# Altium schematic sheet AFPGA.SchDoc: Application FPGA
size 420 x 297 mm; CheckedBy: T.Janicki; CompanyName: Creotech Instruments SA; DrawnBy: G.Kasprowicz; Organization: CERN; Address1: European Organization for Nuclear Research; Address2: CH-1211 Geneve 23 - Switzerland; Revision: -; SheetNumber: 2; SheetTotal: 21; EDA_Number: EDA-xxxx; Projet: Simple VME FMC Carrier; ModifiedBy: -; CreateDate: 20/11/2012; CheckedDate: 30/04/2012; DivGrp: BE-CO; Designer: G.Kasprowicz; PageSetup: Record=PageOptions|CenterHorizontal=True|CenterVertical=True|PrintScale=0.95|XCorrection=1.00|YCorrection=1.00|PrintKind=1|BorderSize=5000000|LeftOffset=0|BottomOffset=0|Orientation=2|PaperLength=1000|PaperWidth=1000|Scale=100|PaperSource=15|PrintQuality=600|MediaType=1|DitherType=10|PaperKind=A3|PrintScaleMode=1; ModifiedDate: -
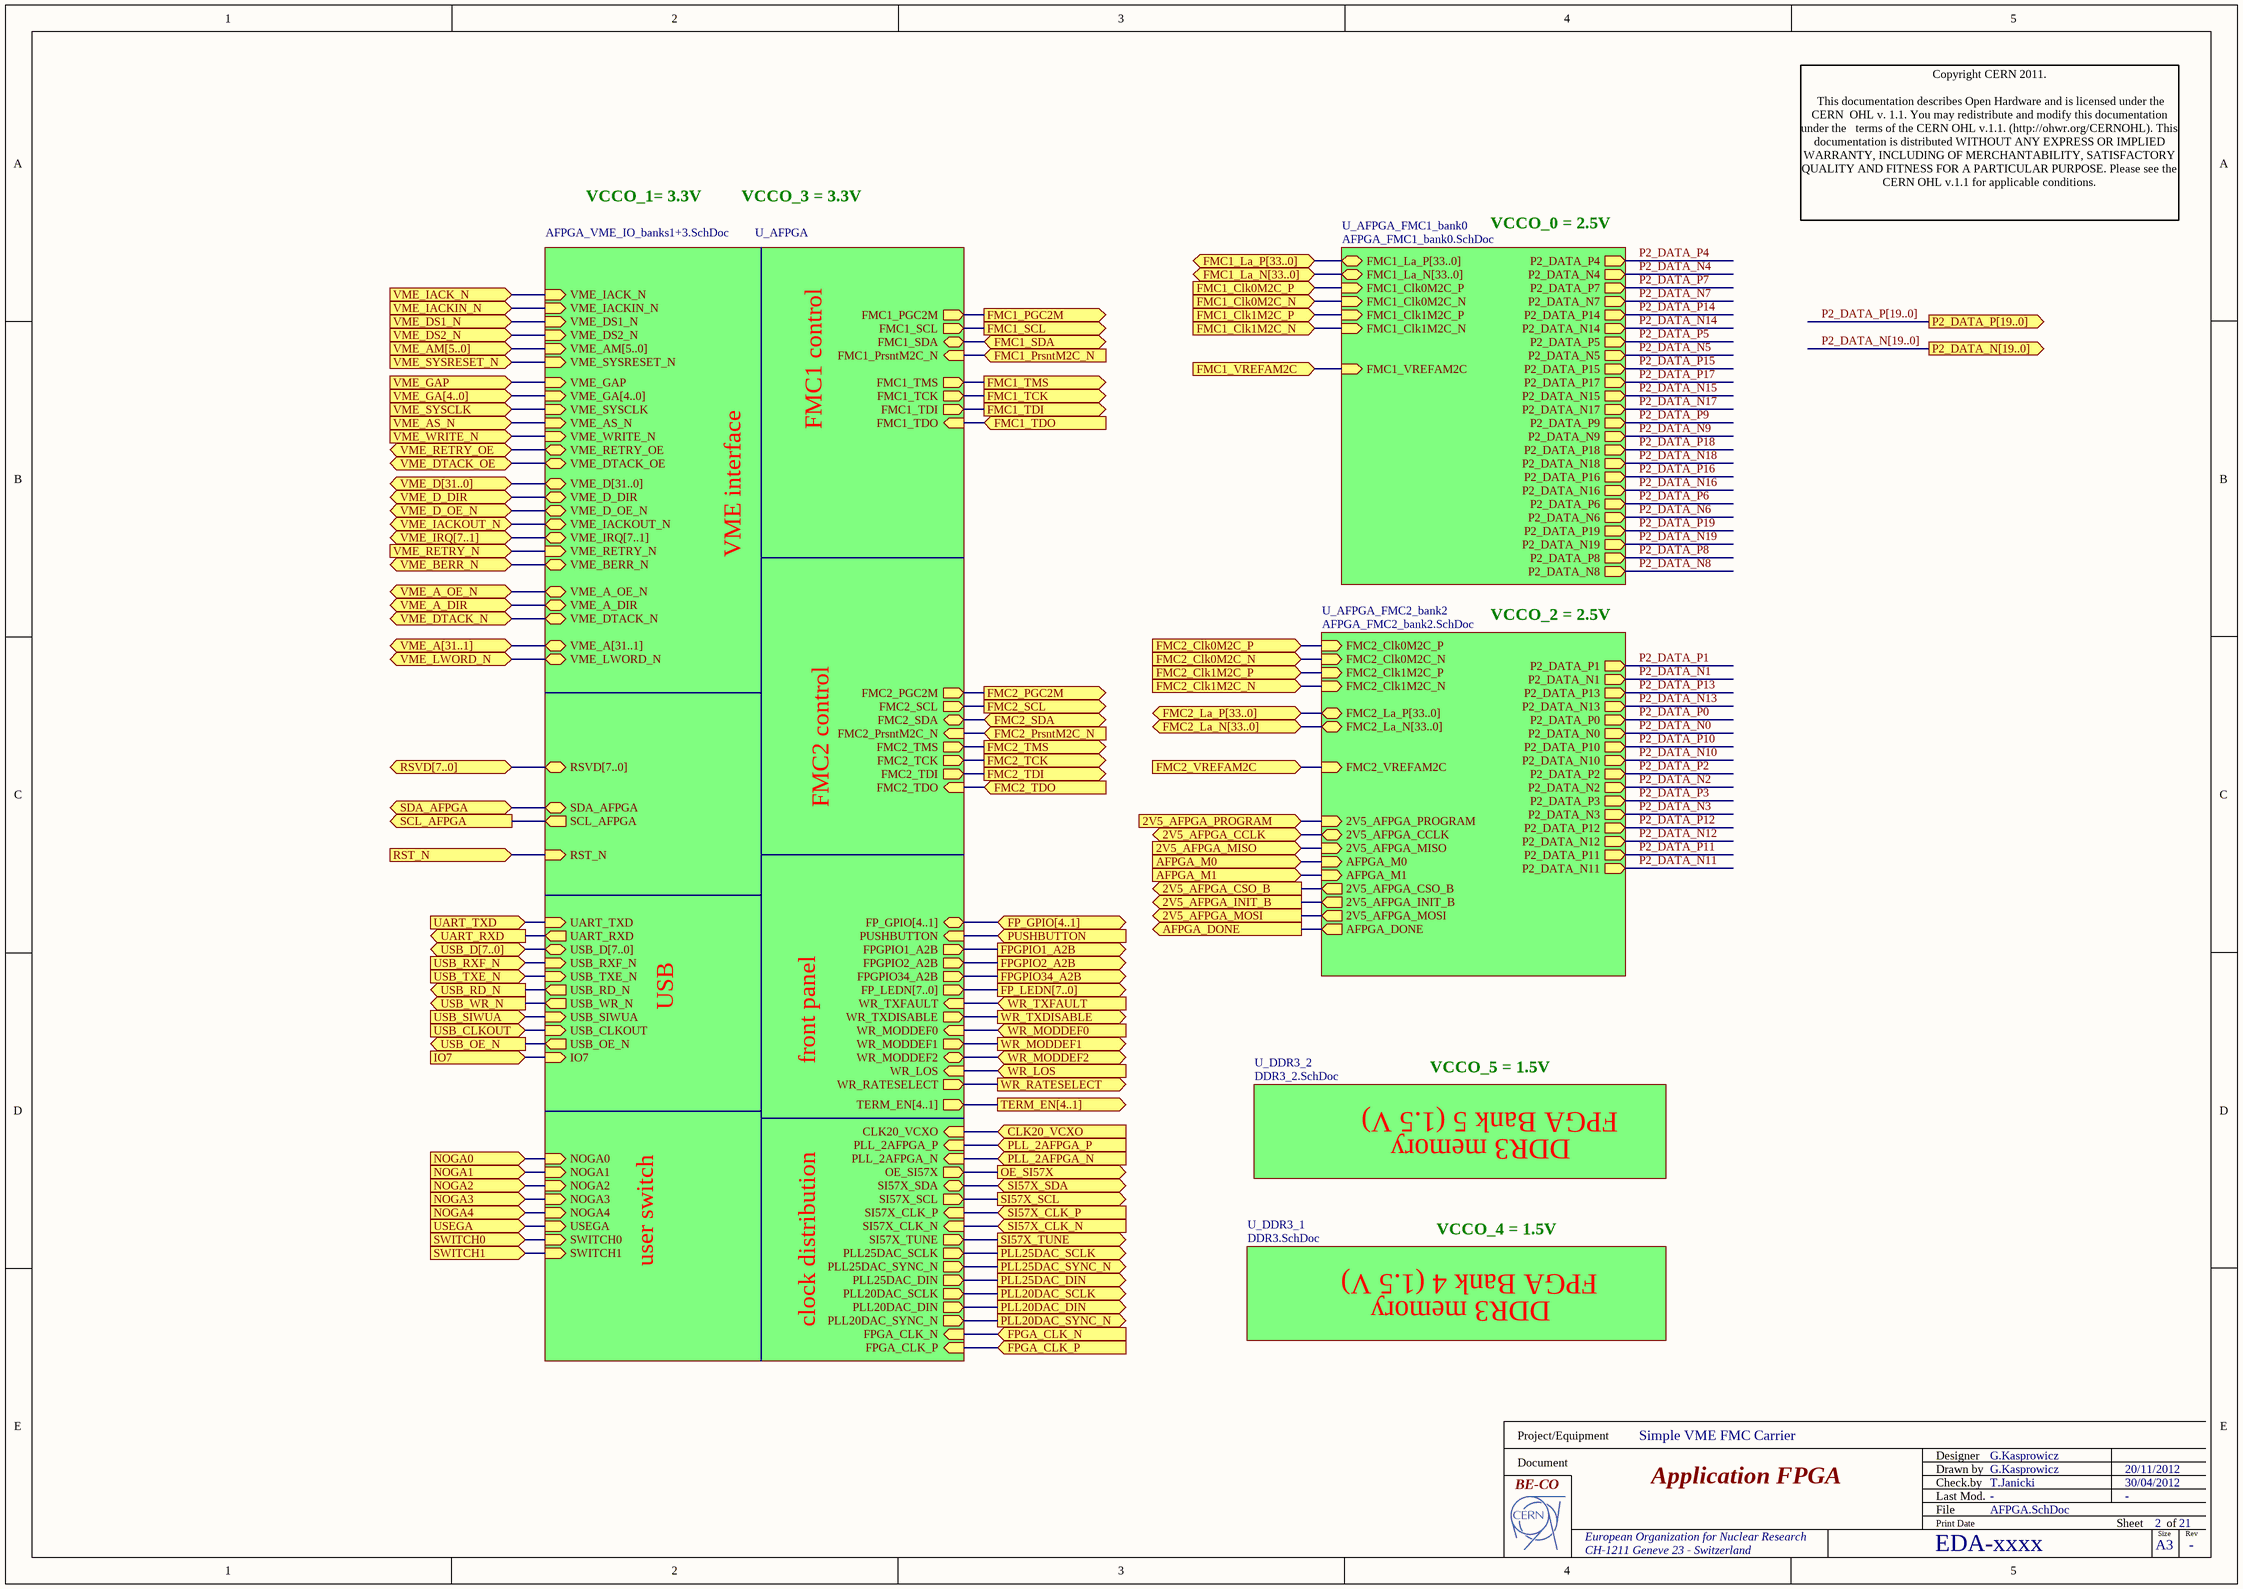
[diagram p0: AFPGA.SchDoc]

## Sub-sheets
U_AFPGA = AFPGA_VME_IO_banks1+3.SchDoc: UART_TXD (in), UART_RXD (out), USB_D[7..0] (bidir), USB_RXF_N (in), USB_TXE_N (in), USB_RD_N (out), USB_WR_N (out), USB_SIWUA (in), USB_CLKOUT (in), USB_OE_N (out), IO7 (in), RST_N (in), PUSHBUTTON (in), WR_TXFAULT (in), WR_TXDISABLE (out), WR_MODDEF0 (in), WR_MODDEF1 (out), WR_MODDEF2 (bidir), WR_LOS (in), WR_RATESELECT (out), FP_LEDN[7..0] (out), FPGPIO1_A2B (out), FPGPIO2_A2B (out), FPGPIO34_A2B (out), FP_GPIO[4..1] (bidir), PLL_2AFPGA_P (in), PLL_2AFPGA_N (in), SI57X_SDA (bidir), SI57X_CLK_P (in), SI57X_CLK_N (in), SI57X_SCL (out), OE_SI57X (out), SI57X_TUNE (out), PLL25DAC_SCLK (out), PLL25DAC_DIN (out), CLK20_VCXO (in), FPGA_CLK_P (in), FPGA_CLK_N (in), NOGA0 (in), NOGA1 (in), NOGA2 (in), NOGA3 (in), NOGA4 (in), USEGA (in), SWITCH0 (in), SWITCH1 (in), TERM_EN[4..1] (out), PLL25DAC_SYNC_N (out), PLL20DAC_SCLK (out), PLL20DAC_DIN (out), PLL20DAC_SYNC_N (out), SDA_AFPGA (bidir), SCL_AFPGA (out), VME_D_DIR (bidir), VME_D_OE_N (bidir), VME_IACKOUT_N (bidir), VME_RETRY_N (in), VME_BERR_N (bidir), VME_A_OE_N (bidir), VME_A_DIR (bidir), VME_DTACK_N (bidir), VME_LWORD_N (bidir), VME_A[31..1] (bidir), VME_IRQ[7..1] (bidir), VME_D[31..0] (bidir), RSVD[7..0] (bidir), VME_RETRY_OE (bidir), VME_DTACK_OE (bidir), VME_SYSCLK (in), VME_AS_N (in), VME_WRITE_N (in), VME_GAP (in), VME_GA[4..0] (in), VME_IACK_N (in), VME_IACKIN_N (in), VME_SYSRESET_N (in), VME_AM[5..0] (in), VME_DS1_N (in), VME_DS2_N (in), FMC1_PGC2M (out), FMC1_SCL (out), FMC1_SDA (bidir), FMC1_PrsntM2C_N (in), FMC1_TMS (out), FMC1_TCK (out), FMC1_TDI (out), FMC1_TDO (in), FMC2_PGC2M (out), FMC2_SCL (out), FMC2_SDA (bidir), FMC2_PrsntM2C_N (in), FMC2_TMS (out), FMC2_TCK (out), FMC2_TDI (out), FMC2_TDO (in)
U_AFPGA_FMC1_bank0 = AFPGA_FMC1_bank0.SchDoc: FMC1_La_P[33..0] (bidir), FMC1_La_N[33..0] (bidir), FMC1_Clk0M2C_P (in), FMC1_Clk0M2C_N (in), FMC1_Clk1M2C_P (in), FMC1_Clk1M2C_N (in), FMC1_VREFAM2C (in), P2_DATA_P4 (out), P2_DATA_N4 (out), P2_DATA_P7 (out), P2_DATA_N7 (out), P2_DATA_P14 (out), P2_DATA_N14 (out), P2_DATA_P5 (out), P2_DATA_N5 (out), P2_DATA_P15 (out), P2_DATA_P17 (out), P2_DATA_N15 (out), P2_DATA_N17 (out), P2_DATA_P9 (out), P2_DATA_N9 (out), P2_DATA_P18 (out), P2_DATA_N18 (out), P2_DATA_P16 (out), P2_DATA_N16 (out), P2_DATA_P6 (out), P2_DATA_N6 (out), P2_DATA_P19 (out), P2_DATA_N19 (out), P2_DATA_P8 (out), P2_DATA_N8 (out)
U_AFPGA_FMC2_bank2 = AFPGA_FMC2_bank2.SchDoc: FMC2_Clk0M2C_P (in), FMC2_Clk0M2C_N (in), FMC2_Clk1M2C_P (in), FMC2_Clk1M2C_N (in), 2V5_AFPGA_PROGRAM (in), FMC2_La_P[33..0] (bidir), FMC2_La_N[33..0] (bidir), 2V5_AFPGA_CCLK (bidir), 2V5_AFPGA_MISO (in), AFPGA_M0 (in), AFPGA_M1 (in), FMC2_VREFAM2C (in), 2V5_AFPGA_CSO_B (out), 2V5_AFPGA_INIT_B (out), 2V5_AFPGA_MOSI (out), AFPGA_DONE (out), P2_DATA_P1 (out), P2_DATA_N1 (out), P2_DATA_P13 (out), P2_DATA_N13 (out), P2_DATA_P0 (out), P2_DATA_N0 (out), P2_DATA_P10 (out), P2_DATA_N10 (out), P2_DATA_P2 (out), P2_DATA_N2 (out), P2_DATA_P3 (out), P2_DATA_N3 (out), P2_DATA_P12 (out), P2_DATA_N12 (out), P2_DATA_P11 (out), P2_DATA_N11 (out)
U_DDR3_1 = DDR3.SchDoc: no entries
U_DDR3_2 = DDR3_2.SchDoc: no entries

## Ports
2V5_AFPGA_CCLK (bidir), 2V5_AFPGA_CSO_B (out), 2V5_AFPGA_INIT_B (out), 2V5_AFPGA_MISO (in), 2V5_AFPGA_MOSI (out), 2V5_AFPGA_PROGRAM (in), AFPGA_DONE (out), AFPGA_M0 (in), AFPGA_M1 (in), CLK20_VCXO (in), FMC1_Clk0M2C_N (in), FMC1_Clk0M2C_P (in), FMC1_Clk1M2C_N (in), FMC1_Clk1M2C_P (in), FMC1_La_N[33..0] (bidir), FMC1_La_P[33..0] (bidir), FMC1_PGC2M (out), FMC1_PrsntM2C_N (in), FMC1_SCL (out), FMC1_SDA (bidir), FMC1_TCK (out), FMC1_TDI (out), FMC1_TDO (in), FMC1_TMS (out), FMC1_VREFAM2C (in), FMC2_Clk0M2C_N (in), FMC2_Clk0M2C_P (in), FMC2_Clk1M2C_N (in), FMC2_Clk1M2C_P (in), FMC2_La_N[33..0] (bidir), FMC2_La_P[33..0] (bidir), FMC2_PGC2M (out), FMC2_PrsntM2C_N (in), FMC2_SCL (out), FMC2_SDA (bidir), FMC2_TCK (out), FMC2_TDI (out), FMC2_TDO (in), FMC2_TMS (out), FMC2_VREFAM2C (in), FP_GPIO[4..1] (bidir), FP_LEDN[7..0] (out), FPGA_CLK_N (in), FPGA_CLK_P (in), FPGPIO1_A2B (out), FPGPIO2_A2B (out), FPGPIO34_A2B (out), IO7 (in), NOGA0 (in), NOGA1 (in), NOGA2 (in), NOGA3 (in), NOGA4 (in), OE_SI57X (out), P2_DATA_N[19..0] (out), P2_DATA_P[19..0] (out), PLL20DAC_DIN (out), PLL20DAC_SCLK (out), PLL20DAC_SYNC_N (out), PLL25DAC_DIN (out), PLL25DAC_SCLK (out), PLL25DAC_SYNC_N (out), PLL_2AFPGA_N (in), PLL_2AFPGA_P (in), PUSHBUTTON (in), RST_N (in), RSVD[7..0] (bidir), SCL_AFPGA (out), SDA_AFPGA (bidir), SI57X_CLK_N (in), SI57X_CLK_P (in), SI57X_SCL (out), SI57X_SDA (bidir), SI57X_TUNE (out), SWITCH0 (in), SWITCH1 (in), TERM_EN[4..1] (out), UART_RXD (out), UART_TXD (in), USB_CLKOUT (in), USB_D[7..0] (bidir), USB_OE_N (out), USB_RD_N (out), USB_RXF_N (in), USB_SIWUA (in), USB_TXE_N (in), USB_WR_N (out), USEGA (in), VME_A[31..1] (bidir), VME_A_DIR (bidir), VME_A_OE_N (bidir), VME_AM[5..0] (in), VME_AS_N (in), VME_BERR_N (bidir), VME_D[31..0] (bidir), VME_D_DIR (bidir), VME_D_OE_N (bidir), VME_DS1_N (in), VME_DS2_N (in), VME_DTACK_N (bidir), VME_DTACK_OE (bidir), VME_GA[4..0] (in), VME_GAP (in), VME_IACK_N (in), VME_IACKIN_N (in), VME_IACKOUT_N (bidir), VME_IRQ[7..1] (bidir), VME_LWORD_N (bidir), VME_RETRY_N (in), VME_RETRY_OE (bidir), VME_SYSCLK (in), VME_SYSRESET_N (in), VME_WRITE_N (in), WR_LOS (in), WR_MODDEF0 (in), WR_MODDEF1 (out), WR_MODDEF2 (bidir), WR_RATESELECT (out), WR_TXDISABLE (out), WR_TXFAULT (in)

## Nets
2V5_AFPGA_CCLK: port 2V5_AFPGA_CCLK, sheet U_AFPGA_FMC2_bank2/2V5_AFPGA_CCLK
2V5_AFPGA_CSO_B: port 2V5_AFPGA_CSO_B, sheet U_AFPGA_FMC2_bank2/2V5_AFPGA_CSO_B
2V5_AFPGA_INIT_B: port 2V5_AFPGA_INIT_B, sheet U_AFPGA_FMC2_bank2/2V5_AFPGA_INIT_B
2V5_AFPGA_MISO: port 2V5_AFPGA_MISO, sheet U_AFPGA_FMC2_bank2/2V5_AFPGA_MISO
2V5_AFPGA_MOSI: port 2V5_AFPGA_MOSI, sheet U_AFPGA_FMC2_bank2/2V5_AFPGA_MOSI
2V5_AFPGA_PROGRAM: port 2V5_AFPGA_PROGRAM, sheet U_AFPGA_FMC2_bank2/2V5_AFPGA_PROGRAM
AFPGA_DONE: port AFPGA_DONE, sheet U_AFPGA_FMC2_bank2/AFPGA_DONE
AFPGA_M0: port AFPGA_M0, sheet U_AFPGA_FMC2_bank2/AFPGA_M0
AFPGA_M1: port AFPGA_M1, sheet U_AFPGA_FMC2_bank2/AFPGA_M1
CLK20_VCXO: port CLK20_VCXO, sheet U_AFPGA/CLK20_VCXO
FMC1_Clk0M2C_N: port FMC1_Clk0M2C_N, sheet U_AFPGA_FMC1_bank0/FMC1_Clk0M2C_N
FMC1_Clk0M2C_P: port FMC1_Clk0M2C_P, sheet U_AFPGA_FMC1_bank0/FMC1_Clk0M2C_P
FMC1_Clk1M2C_N: port FMC1_Clk1M2C_N, sheet U_AFPGA_FMC1_bank0/FMC1_Clk1M2C_N
FMC1_Clk1M2C_P: port FMC1_Clk1M2C_P, sheet U_AFPGA_FMC1_bank0/FMC1_Clk1M2C_P
FMC1_PGC2M: port FMC1_PGC2M, sheet U_AFPGA/FMC1_PGC2M
FMC1_PrsntM2C_N: port FMC1_PrsntM2C_N, sheet U_AFPGA/FMC1_PrsntM2C_N
FMC1_SCL: port FMC1_SCL, sheet U_AFPGA/FMC1_SCL
FMC1_SDA: port FMC1_SDA, sheet U_AFPGA/FMC1_SDA
FMC1_TCK: port FMC1_TCK, sheet U_AFPGA/FMC1_TCK
FMC1_TDI: port FMC1_TDI, sheet U_AFPGA/FMC1_TDI
FMC1_TDO: port FMC1_TDO, sheet U_AFPGA/FMC1_TDO
FMC1_TMS: port FMC1_TMS, sheet U_AFPGA/FMC1_TMS
FMC1_VREFAM2C: port FMC1_VREFAM2C, sheet U_AFPGA_FMC1_bank0/FMC1_VREFAM2C
FMC2_Clk0M2C_N: port FMC2_Clk0M2C_N, sheet U_AFPGA_FMC2_bank2/FMC2_Clk0M2C_N
FMC2_Clk0M2C_P: port FMC2_Clk0M2C_P, sheet U_AFPGA_FMC2_bank2/FMC2_Clk0M2C_P
FMC2_Clk1M2C_N: port FMC2_Clk1M2C_N, sheet U_AFPGA_FMC2_bank2/FMC2_Clk1M2C_N
FMC2_Clk1M2C_P: port FMC2_Clk1M2C_P, sheet U_AFPGA_FMC2_bank2/FMC2_Clk1M2C_P
FMC2_PGC2M: port FMC2_PGC2M, sheet U_AFPGA/FMC2_PGC2M
FMC2_PrsntM2C_N: port FMC2_PrsntM2C_N, sheet U_AFPGA/FMC2_PrsntM2C_N
FMC2_SCL: port FMC2_SCL, sheet U_AFPGA/FMC2_SCL
FMC2_SDA: port FMC2_SDA, sheet U_AFPGA/FMC2_SDA
FMC2_TCK: port FMC2_TCK, sheet U_AFPGA/FMC2_TCK
FMC2_TDI: port FMC2_TDI, sheet U_AFPGA/FMC2_TDI
FMC2_TDO: port FMC2_TDO, sheet U_AFPGA/FMC2_TDO
FMC2_TMS: port FMC2_TMS, sheet U_AFPGA/FMC2_TMS
FMC2_VREFAM2C: port FMC2_VREFAM2C, sheet U_AFPGA_FMC2_bank2/FMC2_VREFAM2C
FPGA_CLK_N: port FPGA_CLK_N, sheet U_AFPGA/FPGA_CLK_N
FPGA_CLK_P: port FPGA_CLK_P, sheet U_AFPGA/FPGA_CLK_P
FPGPIO1_A2B: port FPGPIO1_A2B, sheet U_AFPGA/FPGPIO1_A2B
FPGPIO2_A2B: port FPGPIO2_A2B, sheet U_AFPGA/FPGPIO2_A2B
FPGPIO34_A2B: port FPGPIO34_A2B, sheet U_AFPGA/FPGPIO34_A2B
IO7: port IO7, sheet U_AFPGA/IO7
NOGA0: port NOGA0, sheet U_AFPGA/NOGA0
NOGA1: port NOGA1, sheet U_AFPGA/NOGA1
NOGA2: port NOGA2, sheet U_AFPGA/NOGA2
NOGA3: port NOGA3, sheet U_AFPGA/NOGA3
NOGA4: port NOGA4, sheet U_AFPGA/NOGA4
OE_SI57X: port OE_SI57X, sheet U_AFPGA/OE_SI57X
P2_DATA_N0: sheet U_AFPGA_FMC2_bank2/P2_DATA_N0
P2_DATA_N1: sheet U_AFPGA_FMC2_bank2/P2_DATA_N1
P2_DATA_N2: sheet U_AFPGA_FMC2_bank2/P2_DATA_N2
P2_DATA_N3: sheet U_AFPGA_FMC2_bank2/P2_DATA_N3
P2_DATA_N4: sheet U_AFPGA_FMC1_bank0/P2_DATA_N4
P2_DATA_N5: sheet U_AFPGA_FMC1_bank0/P2_DATA_N5
P2_DATA_N6: sheet U_AFPGA_FMC1_bank0/P2_DATA_N6
P2_DATA_N7: sheet U_AFPGA_FMC1_bank0/P2_DATA_N7
P2_DATA_N8: sheet U_AFPGA_FMC1_bank0/P2_DATA_N8
P2_DATA_N9: sheet U_AFPGA_FMC1_bank0/P2_DATA_N9
P2_DATA_N10: sheet U_AFPGA_FMC2_bank2/P2_DATA_N10
P2_DATA_N11: sheet U_AFPGA_FMC2_bank2/P2_DATA_N11
P2_DATA_N12: sheet U_AFPGA_FMC2_bank2/P2_DATA_N12
P2_DATA_N13: sheet U_AFPGA_FMC2_bank2/P2_DATA_N13
P2_DATA_N14: sheet U_AFPGA_FMC1_bank0/P2_DATA_N14
P2_DATA_N15: sheet U_AFPGA_FMC1_bank0/P2_DATA_N15
P2_DATA_N16: sheet U_AFPGA_FMC1_bank0/P2_DATA_N16
P2_DATA_N17: sheet U_AFPGA_FMC1_bank0/P2_DATA_N17
P2_DATA_N18: sheet U_AFPGA_FMC1_bank0/P2_DATA_N18
P2_DATA_N19: sheet U_AFPGA_FMC1_bank0/P2_DATA_N19
P2_DATA_P0: sheet U_AFPGA_FMC2_bank2/P2_DATA_P0
P2_DATA_P1: sheet U_AFPGA_FMC2_bank2/P2_DATA_P1
P2_DATA_P2: sheet U_AFPGA_FMC2_bank2/P2_DATA_P2
P2_DATA_P3: sheet U_AFPGA_FMC2_bank2/P2_DATA_P3
P2_DATA_P4: sheet U_AFPGA_FMC1_bank0/P2_DATA_P4
P2_DATA_P5: sheet U_AFPGA_FMC1_bank0/P2_DATA_P5
P2_DATA_P6: sheet U_AFPGA_FMC1_bank0/P2_DATA_P6
P2_DATA_P7: sheet U_AFPGA_FMC1_bank0/P2_DATA_P7
P2_DATA_P8: sheet U_AFPGA_FMC1_bank0/P2_DATA_P8
P2_DATA_P9: sheet U_AFPGA_FMC1_bank0/P2_DATA_P9
P2_DATA_P10: sheet U_AFPGA_FMC2_bank2/P2_DATA_P10
P2_DATA_P11: sheet U_AFPGA_FMC2_bank2/P2_DATA_P11
P2_DATA_P12: sheet U_AFPGA_FMC2_bank2/P2_DATA_P12
P2_DATA_P13: sheet U_AFPGA_FMC2_bank2/P2_DATA_P13
P2_DATA_P14: sheet U_AFPGA_FMC1_bank0/P2_DATA_P14
P2_DATA_P15: sheet U_AFPGA_FMC1_bank0/P2_DATA_P15
P2_DATA_P16: sheet U_AFPGA_FMC1_bank0/P2_DATA_P16
P2_DATA_P17: sheet U_AFPGA_FMC1_bank0/P2_DATA_P17
P2_DATA_P18: sheet U_AFPGA_FMC1_bank0/P2_DATA_P18
P2_DATA_P19: sheet U_AFPGA_FMC1_bank0/P2_DATA_P19
PLL20DAC_DIN: port PLL20DAC_DIN, sheet U_AFPGA/PLL20DAC_DIN
PLL20DAC_SCLK: port PLL20DAC_SCLK, sheet U_AFPGA/PLL20DAC_SCLK
PLL20DAC_SYNC_N: port PLL20DAC_SYNC_N, sheet U_AFPGA/PLL20DAC_SYNC_N
PLL25DAC_DIN: port PLL25DAC_DIN, sheet U_AFPGA/PLL25DAC_DIN
PLL25DAC_SCLK: port PLL25DAC_SCLK, sheet U_AFPGA/PLL25DAC_SCLK
PLL25DAC_SYNC_N: port PLL25DAC_SYNC_N, sheet U_AFPGA/PLL25DAC_SYNC_N
PLL_2AFPGA_N: port PLL_2AFPGA_N, sheet U_AFPGA/PLL_2AFPGA_N
PLL_2AFPGA_P: port PLL_2AFPGA_P, sheet U_AFPGA/PLL_2AFPGA_P
PUSHBUTTON: port PUSHBUTTON, sheet U_AFPGA/PUSHBUTTON
RST_N: port RST_N, sheet U_AFPGA/RST_N
SCL_AFPGA: port SCL_AFPGA, sheet U_AFPGA/SCL_AFPGA
SDA_AFPGA: port SDA_AFPGA, sheet U_AFPGA/SDA_AFPGA
SI57X_CLK_N: port SI57X_CLK_N, sheet U_AFPGA/SI57X_CLK_N
SI57X_CLK_P: port SI57X_CLK_P, sheet U_AFPGA/SI57X_CLK_P
SI57X_SCL: port SI57X_SCL, sheet U_AFPGA/SI57X_SCL
SI57X_SDA: port SI57X_SDA, sheet U_AFPGA/SI57X_SDA
SI57X_TUNE: port SI57X_TUNE, sheet U_AFPGA/SI57X_TUNE
SWITCH0: port SWITCH0, sheet U_AFPGA/SWITCH0
SWITCH1: port SWITCH1, sheet U_AFPGA/SWITCH1
UART_RXD: port UART_RXD, sheet U_AFPGA/UART_RXD
UART_TXD: port UART_TXD, sheet U_AFPGA/UART_TXD
USB_CLKOUT: port USB_CLKOUT, sheet U_AFPGA/USB_CLKOUT
USB_OE_N: port USB_OE_N, sheet U_AFPGA/USB_OE_N
USB_RD_N: port USB_RD_N, sheet U_AFPGA/USB_RD_N
USB_RXF_N: port USB_RXF_N, sheet U_AFPGA/USB_RXF_N
USB_SIWUA: port USB_SIWUA, sheet U_AFPGA/USB_SIWUA
USB_TXE_N: port USB_TXE_N, sheet U_AFPGA/USB_TXE_N
USB_WR_N: port USB_WR_N, sheet U_AFPGA/USB_WR_N
USEGA: port USEGA, sheet U_AFPGA/USEGA
VME_A_DIR: port VME_A_DIR, sheet U_AFPGA/VME_A_DIR
VME_A_OE_N: port VME_A_OE_N, sheet U_AFPGA/VME_A_OE_N
VME_AS_N: port VME_AS_N, sheet U_AFPGA/VME_AS_N
VME_BERR_N: port VME_BERR_N, sheet U_AFPGA/VME_BERR_N
VME_D_DIR: port VME_D_DIR, sheet U_AFPGA/VME_D_DIR
VME_D_OE_N: port VME_D_OE_N, sheet U_AFPGA/VME_D_OE_N
VME_DS1_N: port VME_DS1_N, sheet U_AFPGA/VME_DS1_N
VME_DS2_N: port VME_DS2_N, sheet U_AFPGA/VME_DS2_N
VME_DTACK_N: port VME_DTACK_N, sheet U_AFPGA/VME_DTACK_N
VME_DTACK_OE: port VME_DTACK_OE, sheet U_AFPGA/VME_DTACK_OE
VME_GAP: port VME_GAP, sheet U_AFPGA/VME_GAP
VME_IACK_N: port VME_IACK_N, sheet U_AFPGA/VME_IACK_N
VME_IACKIN_N: port VME_IACKIN_N, sheet U_AFPGA/VME_IACKIN_N
VME_IACKOUT_N: port VME_IACKOUT_N, sheet U_AFPGA/VME_IACKOUT_N
VME_LWORD_N: port VME_LWORD_N, sheet U_AFPGA/VME_LWORD_N
VME_RETRY_N: port VME_RETRY_N, sheet U_AFPGA/VME_RETRY_N
VME_RETRY_OE: port VME_RETRY_OE, sheet U_AFPGA/VME_RETRY_OE
VME_SYSCLK: port VME_SYSCLK, sheet U_AFPGA/VME_SYSCLK
VME_SYSRESET_N: port VME_SYSRESET_N, sheet U_AFPGA/VME_SYSRESET_N
VME_WRITE_N: port VME_WRITE_N, sheet U_AFPGA/VME_WRITE_N
WR_LOS: port WR_LOS, sheet U_AFPGA/WR_LOS
WR_MODDEF0: port WR_MODDEF0, sheet U_AFPGA/WR_MODDEF0
WR_MODDEF1: port WR_MODDEF1, sheet U_AFPGA/WR_MODDEF1
WR_MODDEF2: port WR_MODDEF2, sheet U_AFPGA/WR_MODDEF2
WR_RATESELECT: port WR_RATESELECT, sheet U_AFPGA/WR_RATESELECT
WR_TXDISABLE: port WR_TXDISABLE, sheet U_AFPGA/WR_TXDISABLE
WR_TXFAULT: port WR_TXFAULT, sheet U_AFPGA/WR_TXFAULT

## Buses and harness runs
bus P2_DATA_N[19..0] = port P2_DATA_N[19..0]
bus P2_DATA_P[19..0] = port P2_DATA_P[19..0]
bus port FMC1_La_N[33..0] = sheet U_AFPGA_FMC1_bank0/FMC1_La_N[33..0]
bus port FMC1_La_P[33..0] = sheet U_AFPGA_FMC1_bank0/FMC1_La_P[33..0]
bus port FMC2_La_N[33..0] = sheet U_AFPGA_FMC2_bank2/FMC2_La_N[33..0]
bus port FMC2_La_P[33..0] = sheet U_AFPGA_FMC2_bank2/FMC2_La_P[33..0]
bus port FP_GPIO[4..1] = sheet U_AFPGA/FP_GPIO[4..1]
bus port FP_LEDN[7..0] = sheet U_AFPGA/FP_LEDN[7..0]
bus port RSVD[7..0] = sheet U_AFPGA/RSVD[7..0]
bus port TERM_EN[4..1] = sheet U_AFPGA/TERM_EN[4..1]
bus port USB_D[7..0] = sheet U_AFPGA/USB_D[7..0]
bus port VME_A[31..1] = sheet U_AFPGA/VME_A[31..1]
bus port VME_AM[5..0] = sheet U_AFPGA/VME_AM[5..0]
bus port VME_D[31..0] = sheet U_AFPGA/VME_D[31..0]
bus port VME_GA[4..0] = sheet U_AFPGA/VME_GA[4..0]
bus port VME_IRQ[7..1] = sheet U_AFPGA/VME_IRQ[7..1]

## Notes on the sheet
- VCCO_1= 3.3V
- VCCO_3 = 3.3V
- VCCO_0 = 2.5V
- Copyright CERN 2011.
  This documentation describes Open Hardware and is licensed under the CERN  OHL v. 1.1. You may redistribute and modify this documentation under the   terms of the CERN OHL v.1.1. (http://ohwr.org/CERNOHL). This  documentation is distributed WITHOUT ANY EXPRESS OR IMPLIED  WARRANTY, INCLUDING OF MERCHANTABILITY, SATISFACTORY  QUALITY AND FITNESS FOR A PARTICULAR PURPOSE. Please see the  CERN OHL v.1.1 for applicable conditions.
- FMC1 control
- VME interface
- VCCO_2 = 2.5V
- FMC2 control
- USB
- front panel
- VCCO_5 = 1.5V
- DDR3 memory
- FPGA Bank 5 (1.5 V)
- user switch
- VCCO_4 = 1.5V
- FPGA Bank 4 (1.5 V)
- clock distribution
- Project/Equipment
- Document
- Designer
- Drawn by
- Check.by
- File
- Last Mod.
- Print Date
- Sheet
- Size
- A3
- of
- Rev